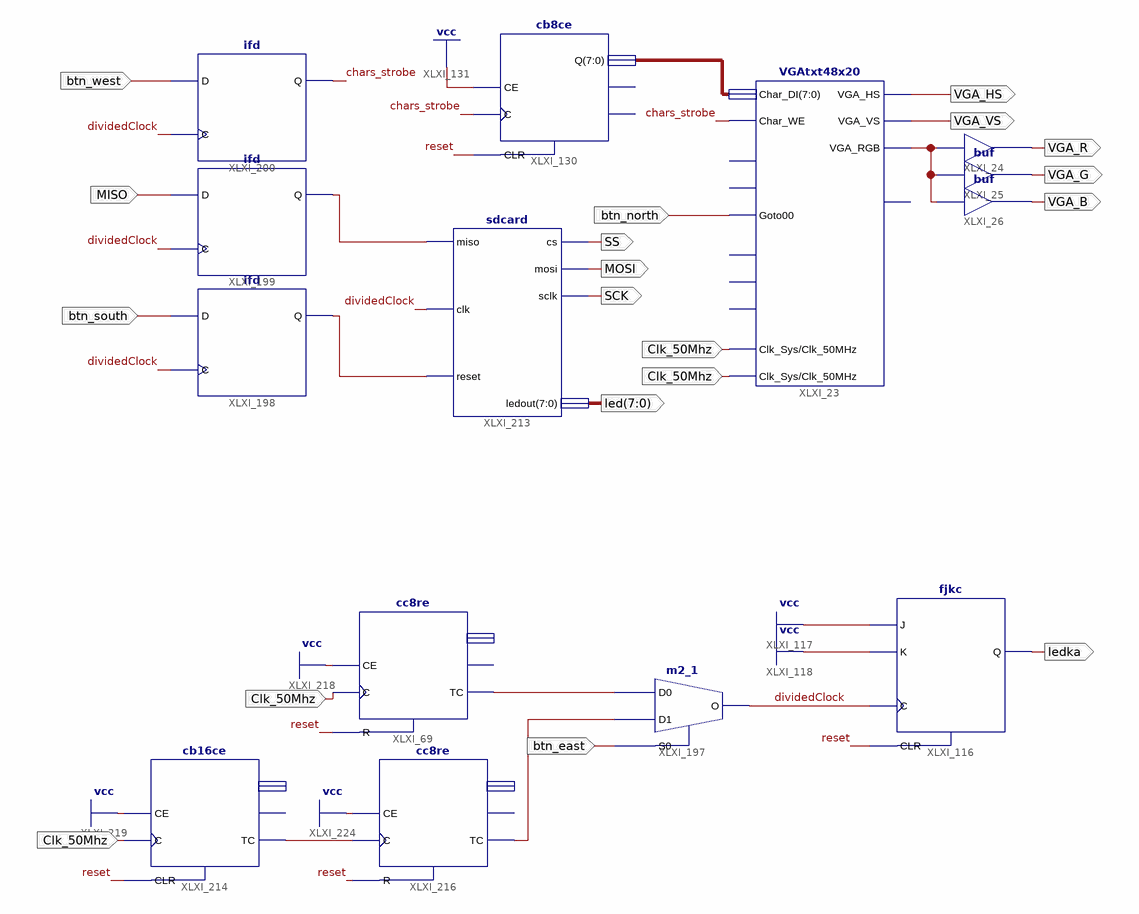
[diagram p0: schematic sheet 1]
// Xilinx ISE schematic starySchemat.sch (spartan3e) as structural Verilog: 14 symbols, 16 ports
module starySchemat (
  input  Clk_50Mhz,
  input  btn_east,
  input  btn_west,
  input  MISO,
  input  btn_south,
  input  btn_north,
  output ledka,
  output VGA_VS,
  output [7:0] led,
  output VGA_HS,
  output VGA_R,
  output VGA_G,
  output VGA_B,
  output SCK,
  output MOSI,
  output SS
);

  wire chars_strobe, dividedClock, reset, XLXN_88, XLXN_182, XLXN_191, XLXN_248, XLXN_277, XLXN_305;
  wire [7:0] XLXN_255;

  cc8re XLXI_69 (.C(Clk_50Mhz), .CE(1'b1), .R(reset), .TC(XLXN_248));  // open: CEO, Q
  m2_1 XLXI_197 (.D0(XLXN_248), .D1(XLXN_305), .S0(btn_east), .O(dividedClock));
  cc8re XLXI_216 (.C(XLXN_191), .CE(1'b1), .R(reset), .TC(XLXN_305));  // open: CEO, Q
  fjkc XLXI_116 (.C(dividedClock), .CLR(reset), .J(1'b1), .K(1'b1), .Q(ledka));
  cb16ce XLXI_214 (.C(Clk_50Mhz), .CE(1'b1), .CLR(reset), .TC(XLXN_191));  // open: CEO, Q
  VGAtxt48x20 XLXI_23 (
    .Char_DI(XLXN_255), .Goto00(btn_north), .Clk_Sys(Clk_50Mhz), .Clk_50MHz(Clk_50Mhz), .VGA_HS(VGA_HS),
    .VGA_VS(VGA_VS), .VGA_RGB(XLXN_88), .Char_WE(chars_strobe));  // open: Home, NewLine, CursorOn, ScrollEn, ScrollClear, Busy
  ifd XLXI_198 (.C(dividedClock), .D(btn_south), .Q(XLXN_182));
  ifd XLXI_199 (.C(dividedClock), .D(MISO), .Q(XLXN_277));
  ifd XLXI_200 (.C(dividedClock), .D(btn_west), .Q(chars_strobe));
  buf XLXI_24 (VGA_R, XLXN_88);
  buf XLXI_25 (VGA_G, XLXN_88);
  buf XLXI_26 (VGA_B, XLXN_88);
  sdcard XLXI_213 (
    .miso(XLXN_277), .clk(dividedClock), .reset(XLXN_182), .cs(SS), .mosi(MOSI), .sclk(SCK), .ledout(led));
  cb8ce XLXI_130 (.C(chars_strobe), .CE(1'b1), .CLR(reset), .Q(XLXN_255));  // open: CEO, TC
endmodule
